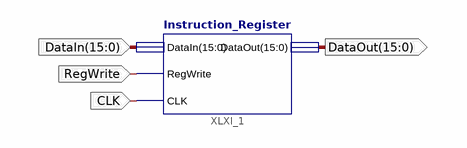
[diagram p0: schematic sheet 1]
// Xilinx ISE schematic EPC.sch (spartan3e) as structural Verilog: 1 symbols, 4 ports
module EPC (
  input  RegWrite,
  input  CLK,
  input  [15:0] DataIn,
  output [15:0] DataOut
);

  Instruction_Register XLXI_1 (.DataIn(DataIn), .RegWrite(RegWrite), .CLK(CLK), .DataOut(DataOut));
endmodule
